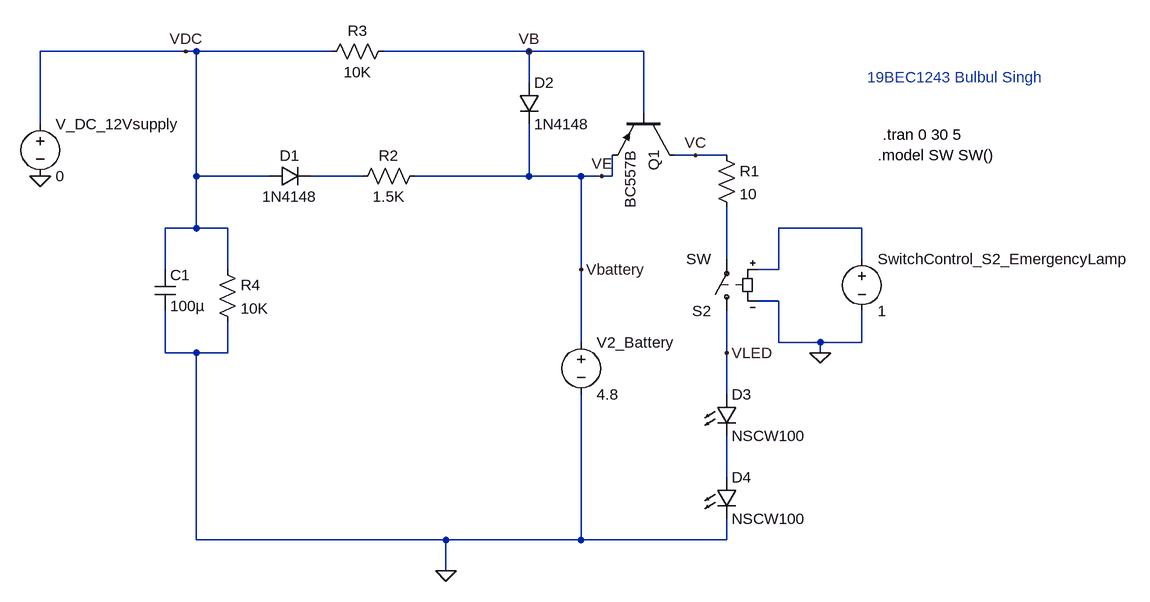
[diagram p0: schematic lab11_exp_5.asc]
lab11_exp_5.asc, the LTspice schematic file:
Version 4
SHEET 1 984 680
WIRE -496 -144 -720 -144
WIRE -480 -144 -496 -144
WIRE -272 -144 -480 -144
WIRE 32 -144 -192 -144
WIRE 208 -144 32 -144
WIRE 32 -96 32 -144
WIRE 208 -48 208 -144
WIRE -720 -32 -720 -144
WIRE 288 16 256 16
WIRE 336 16 288 16
WIRE -480 48 -480 -144
WIRE -368 48 -480 48
WIRE -224 48 -304 48
WIRE 32 48 32 -32
WIRE 32 48 -144 48
WIRE 112 48 32 48
WIRE 144 48 112 48
WIRE 160 48 160 16
WIRE 160 48 144 48
WIRE -480 128 -480 48
WIRE -480 128 -528 128
WIRE -432 128 -480 128
WIRE 544 128 416 128
WIRE 336 176 336 96
WIRE 544 176 544 128
WIRE -528 192 -528 128
WIRE -432 192 -432 128
WIRE 112 192 112 48
WIRE 416 192 416 128
WIRE 416 192 384 192
WIRE 416 240 384 240
WIRE 112 304 112 192
WIRE 416 304 416 240
WIRE 480 304 416 304
WIRE 544 304 544 256
WIRE 544 304 480 304
WIRE -528 320 -528 256
WIRE -480 320 -528 320
WIRE -432 320 -432 272
WIRE -432 320 -480 320
WIRE 336 320 336 256
WIRE 480 320 480 304
WIRE 336 384 336 320
WIRE 336 512 336 448
WIRE -480 608 -480 320
WIRE -96 608 -480 608
WIRE 112 608 112 384
WIRE 112 608 -96 608
WIRE 336 608 336 576
WIRE 336 608 112 608
WIRE -96 656 -96 608
FLAG 480 320 0
FLAG -96 656 0
FLAG -720 48 0
FLAG 112 192 Vbattery
FLAG -496 -144 VDC
FLAG 32 -144 VB
FLAG 144 48 VE
FLAG 288 16 VC
FLAG 336 320 VLED
SYMBOL sw 336 272 R180
SYMATTR InstName S2
SYMBOL voltage 544 160 R0
SYMATTR InstName SwitchControl_S2_EmergencyLamp
SYMATTR Value 1
SYMBOL voltage 112 288 R0
SYMATTR InstName V2_Battery
SYMATTR Value 4.8
SYMBOL voltage -720 -48 R0
WINDOW 123 0 0 Left 0
WINDOW 39 0 0 Left 0
SYMATTR InstName V_DC_12Vsupply
SYMATTR Value 0
SYMBOL res 320 0 R0
SYMATTR InstName R1
SYMATTR Value 10
SYMBOL res -128 32 R90
WINDOW 0 0 56 VBottom 2
WINDOW 3 32 56 VTop 2
SYMATTR InstName R2
SYMATTR Value 1.5K
SYMBOL res -176 -160 R90
WINDOW 0 0 56 VBottom 2
WINDOW 3 32 56 VTop 2
SYMATTR InstName R3
SYMATTR Value 10K
SYMBOL res -448 176 R0
SYMATTR InstName R4
SYMATTR Value 10K
SYMBOL diode -368 64 R270
WINDOW 0 32 32 VTop 2
WINDOW 3 0 32 VBottom 2
SYMATTR InstName D1
SYMATTR Value 1N4148
SYMBOL diode 16 -96 R0
SYMATTR InstName D2
SYMATTR Value 1N4148
SYMBOL cap -544 192 R0
SYMATTR InstName C1
SYMATTR Value 100µ
SYMBOL pnp 256 -48 R90
SYMATTR InstName Q1
SYMATTR Value BC557B
SYMBOL LED 320 384 R0
SYMATTR InstName D3
SYMATTR Value NSCW100
SYMBOL LED 320 512 R0
SYMATTR InstName D4
SYMATTR Value NSCW100
TEXT 552 -104 Left 2 ;19BEC1243 Bulbul Singh
TEXT 576 -16 Left 2 !.tran 0 30 5
TEXT 568 16 Left 2 !.model SW SW()

The netlist it stands for:
* lab11_exp_5.asc
S2 VLED N003 N002 0 SW
V§SwitchControl_S2_EmergencyLamp N002 0 1
V2_Battery VE 0 4.8
V_DC_12Vsupply VDC 0 0
R1 VC N003 10
R2 VE N001 1.5K
R3 VB VDC 10K
R4 VDC 0 10K
D1 VDC N001 1N4148
D2 VB VE 1N4148
C1 VDC 0 100µ
Q1 VC VB VE 0 BC557B
D3 VLED N004 NSCW100
D4 N004 0 NSCW100
.model D D
.lib standard.dio
.model NPN NPN
.model PNP PNP
.lib standard.bjt
* 19BEC1243 Bulbul Singh
.tran 0 30 5
.model SW SW()
.backanno
.end